# Altium schematic sheet Buck and Boost Converters.SchDoc
size A; SheetNumber: 3; SheetTotal: 3
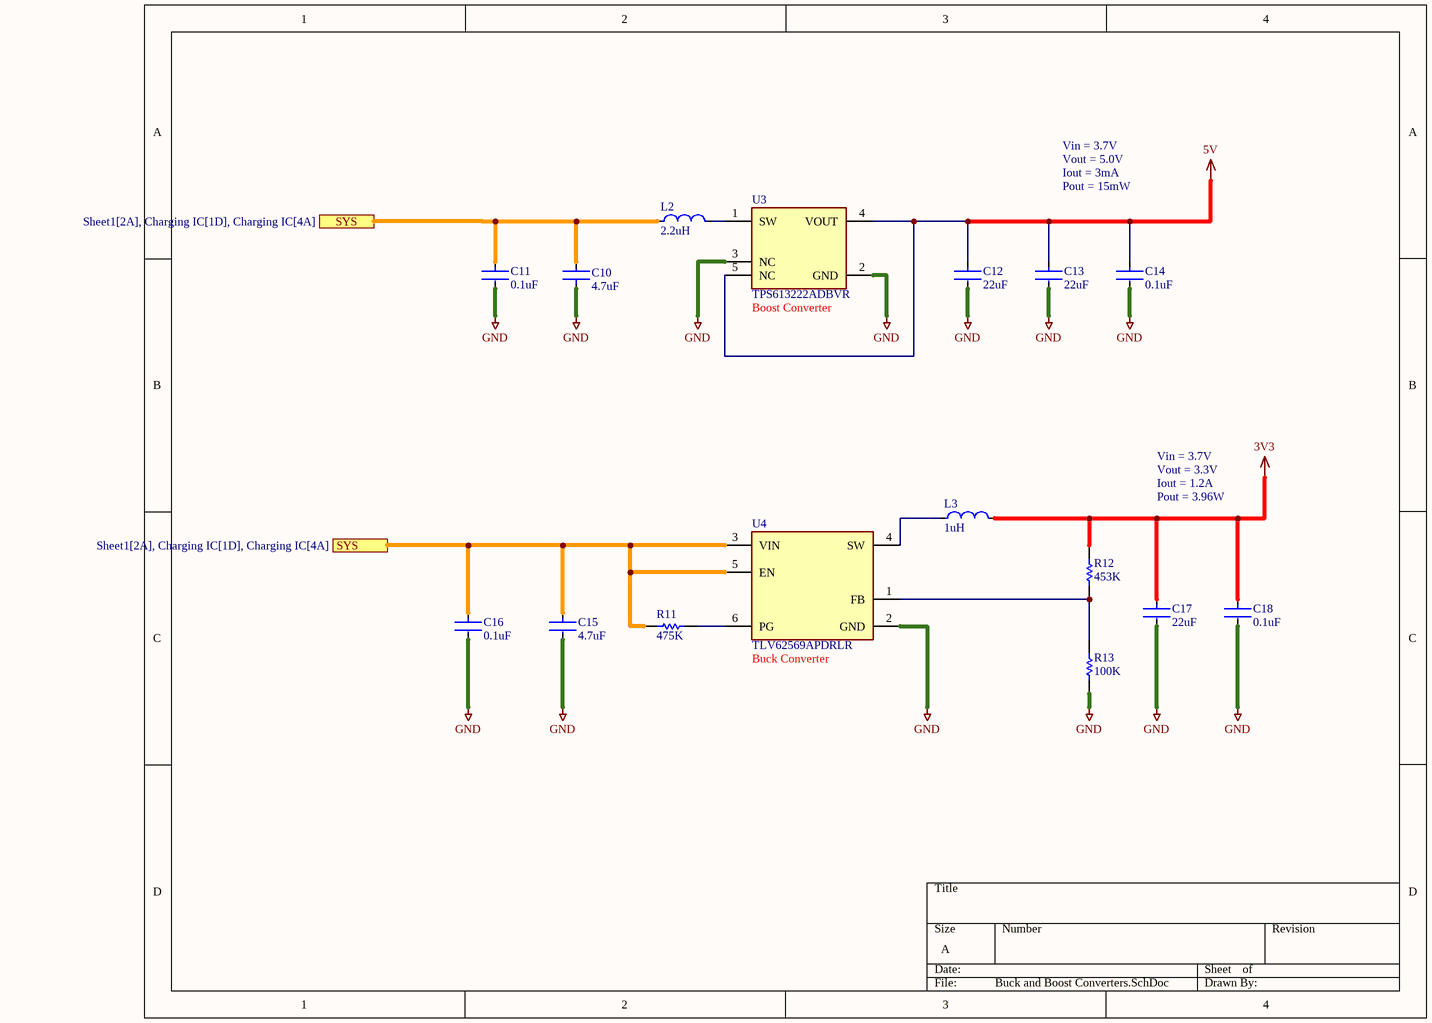
[diagram p0: Buck and Boost Converters.SchDoc]

## Parts
C10  4.7uF  [FP-C0603-CG-MFG]
C11  0.1uF  [FP-CC0603-DA-MFG]
C12  22uF  [FP-GRM188-0_2-IPC_C]
C13  22uF  [FP-GRM188-0_2-IPC_C]
C14  0.1uF  [FP-CC0603-DA-MFG]
C15  4.7uF  [FP-C0603-CG-MFG]
C16  0.1uF  [FP-CC0603-DA-MFG]
C17  22uF  [FP-GRM188-0_2-IPC_C]
C18  0.1uF  [FP-CC0603-DA-MFG]
L2  2.2uH  [FP-CBMF1608-MFG]
L3  1uH  [FP-MLZ1608-MFG]
R11  475K  [RESC1608X55X30LL15T15]
R12  453K  [RESC1608X55X30ML15T15]
R13  100K  [RESC1608X55X30ML20T20]
U3  TPS613222ADBVR  [FP-DBV0005A-MFG]
U4  TLV62569APDRLR  [FP-DRL0006A-MFG]

## Ports
SYS (see Sheet1[2A], Charging IC[1D], Charging IC[4A])

## Nets
3V3: C17.1 C18.1 L3.2 R12.2
5V: C12.1 C13.1 C14.1 U3.4(VOUT) U3.5(NC)
GND: C10.1 C11.2 C12.2 C13.2 C14.2 C15.2 C16.2 C17.2 C18.2 R13.1 U3.2(GND) U3.3(NC) U4.2(GND)
SYS: C10.2 C11.1 C15.1 C16.1 L2.1 R11.1 U4.3(VIN) U4.5(EN) ; port SYS
NetL2_2: L2.2 U3.1(SW)
NetL3_1: L3.1 U4.4(SW)
NetR11_2: R11.2 U4.6(PG)
NetR12_1: R12.1 R13.2 U4.1(FB)

## Notes on the sheet
- Vin = 3.7V
- Vout = 5.0V
- Iout = 3mA
- Pout = 15mW
- (near U3) Boost Converter
- Vout = 3.3V
- Iout = 1.2A
- Pout = 3.96W
- (near U4) Buck Converter

## Library data of the parts
C10 C15 = CMP-2006-02256-2: CAP CER 4.7UF 6.3V X5R 0603; Manufacturer: Kemet; Manufacturer Part Number: C0603C475K9PACTU; Temperature Coefficient: 15%; Tolerance: 10%; Material: Ceramic; Device Class L3: Ceramic Capacitors; RoHS: TRUE; Value: 4.7uF; Lead Free: Yes; ComponentLink2Description: Datasheet; Mouser Description: Multilayer Ceramic Capacitors MLCC - SMD/SMT 6.3volts 4.7uF X5R 10%; Package: C0603-CG; Digikey Description: CAP CER 4.7UF 6.3V X5R 0603; ComponentLink2URL: https://content.kemet.com/datasheets/KEM_C1006_X5R_SMD.pdf; Category: Cap; Temperature Range Low: -55°C; Capacitance: 4.7uF; Temperature: -55°C to +85°C; Octopart: https://octopart.com/c0603c475k9pactu-kemet-104242; Ipc Land Pattern Name: CAPC16080X80; Voltage Rating: 6.3V; Temperature Range High: +85°C; Height: 0.9mm; Temperature Characteristic: X5R; Device Class L1: Passive Components; Automotive: No; Device Class L2: Capacitors
C11 C14 C16 C18 = CMP-2000-05002-2: CAP CER 0.1UF 16V X7R 0603; Manufacturer Part Number: CC0603KRX7R7BB104; Manufacturer: YAGEO; Tolerance: 0.1; Value: 100 nF; Temperature Coefficient: 15%; Material: Ceramic; Voltage Rating: 16 V; Package: CC0603-DA; ComponentLink2Description: Datasheet; Octopart: https://octopart.com/cc0603krx7r7bb104-yageo-192941; Temperature Range High: +125°C; Digikey Description: CAP CER 0.1UF 16V X7R 0603; Voltage: 16 V; Device Class L2: Capacitors; Height: 0.9mm; Temperature: -55°C to +125°C; Device Class L1: Passive Components; Device Class L3: Ceramic Capacitors; ComponentLink2URL: http://www.yageo.com/documents/recent/UPY-GPHC_X7R_6.3V-to-50V_18.pdf; Footprint Url: http://www.yageo.com/exep/pages/download/literatures/UPY-C_GEN_24.pdf; RoHS: TRUE; Temperature Range Low: -55°C; Temperature Characteristic: X7R; Lead Free: Yes; Capacitance: 100 nF; Category: Cap; Mouser Description: Multilayer Ceramic Capacitor, CC Series, 0.1 - F, - 10%, X7R, 16 V, 0603 [1608 Metric]; Automotive: No
C12 C13 C17 = CMP-2000-06337-3: Chip Multilayer Ceramic Capacitors for General Purpose, 0603, 22uF, X5R, 15%, 20%, 10V; Tolerance: 20%; Weight: 0.000222oz; Material: Ceramic; Depth: 0.8mm; Length: 1.6mm; Termination: SMD/SMT; Capacitance: 22uF; Packaging: Tape and Reel; Width: 0.8mm; Voltage Rating: 10V; Case Code (Imperial): 0603; Mount: Surface Mount; Voltage Rating (DC): 10V; Case/Package: 0603; Thickness: 0.039inch; REACH SVHC: No SVHC; Dielectric: X5R; Height: 0.8mm; Package Quantity: 4000; Case Code (Metric): 1608; Min Operating Temperature: -55°C; Lead Free: Lead Free; Max Operating Temperature: 85°C
L2 = CMP-14484-000379-1: SMD Inductors 2.2uH ±20% 0.56A 0.221Ω 0603; Core Material: Ferrite; Shielding: Unshielded; DC Resistance (DCR): 221mR; Current Rating: 560mA; Test Frequency: 7.96MHz; Saturation Current: 190mA; Self Resonant Frequency: 80MHz; Packaging: Tape and Reel; Tolerance: 20%; Width: 0.8mm; Length: 1.6mm; Min Operating Temperature: -40°C; RoHS Compliant: Yes; Halogen Free: Halogen Free; Height: 0.8mm; Package Quantity: 1; Mount: Surface Mount; Depth: 1mm; Height - Seated (Max): 0.039inch; Case Code (Metric): 1608; Series: CBMF; Termination: SMD/SMT; Case Code (Imperial): 0603; Military Standard: Not; Max DC Current: 560mA; Case/Package: 0603; Resistor Type: Wirewound; Radiation Hardening: No; Lead Free: Lead Free; Inductance Tolerance: 20%; DC Current: 560mA; Max Operating Temperature: 105°C; Inductance: 2.2uH
L3 = CMP-08253-000001-2: FIXED IND 1UH 600MA 150 MOHM SMD; Self Resonant Frequency: 170MHz; Shielding: Shielded; Core Material: Ferrite; Tolerance: 20%; Test Frequency: 10MHz; DC Resistance (DCR): 195mR; Saturation Current: 190mA; Case Code (Imperial): 0603; Case Code (Metric): 1608; Current Rating: 600mA; Height - Seated (Max): 0.037inch; RoHS Compliant: Yes; Case/Package: 0603; Length: 0.063inch; Mount: Surface Mount; Package Quantity: 4000; Max Operating Temperature: 125°C; Inductance: 1uH; Min Operating Temperature: -55°C; Width: 0.031inch; Lead Free: Lead Free; Packaging: Tape and Reel
R11 = CMP-2000-00528-1: Manufacturer: Panasonic; Part Number: ERJ-3EKF4753V
R12 = CMP-2000-00514-1: Manufacturer: Panasonic; Part Number: ERJ-3EKF4533V
R13 = CMP-2000-00875-1: Part Number: ERA3AEB104V; Manufacturer: Panasonic
U3 = CMP-04918-000049-1: IC REG BOOST 5V 2.5A SOT23-5; Manufacturer: Texas Instruments; Output Current: 1.8A; Standoff Height: 0mm; Max Junction Temp: +125°C; Switching Frequency: 2000kHz; Output Type: Fixed; Nominal Supply Current: 6.5uA; Min Supply Voltage: 0.9V; Number Of Outputs: 1; Max Supply Voltage: 5.5V; Max Duty Cycle: 90%; Device Class L1: Integrated Circuits (ICs); Mouser Description: 6-uA Quiescent Current, 1.8-A Switch Current Boost Converter 5-SOT-23 -40 to 85; Lead Free: Yes; ComponentLink2Description: Datasheet; Digikey Description: IC REG BOOST 5V 2.5A SOT23-5; Temperature Range High: +85°C; Manufacturer Part Number: TPS613222ADBVR; Device Class L3: Voltage Regulators - Switching; RoHS: TRUE; Ipc Land Pattern Name: SOT95P280X145-5; Switching Topology: Boost; Device Class L2: Power Management ICs; Height: 1.45mm; Output Voltage: 5V; ComponentLink2URL: http://www.ti.com/lit/ds/symlink/tps61322.pdf; Octopart: https://octopart.com/tps613222adbvr-texas+instruments-88135761; Temperature: -40°C to +85°C; Automotive: No; Package: DBV0005A; Temperature Range Low: -40°C; Category: IC
U4 = CMP-04918-000614-1: IC REG BUCK ADJ 2A SOT563; Min Output Voltage: 600mV; Max Input Voltage: 5.5V; Output Type: Adjustable; Min Input Voltage: 2.5V; Output Configuration: Positive; Synchronous Rectifier: Yes; Switching Frequency: 1.5MHz; Mount: Surface Mount; Output Current: 2A; Case/Package: SOT-563; Min Operating Temperature: -40°C; RoHS Compliant: Yes; Packaging: Cut Tape; Max Output Voltage: 5.5V; Max Operating Temperature: 125°C